# Altium schematic sheet [MP] MCU.SchDoc
size 254 x 208 mm; SheetNumber: 2; SheetTotal: 8
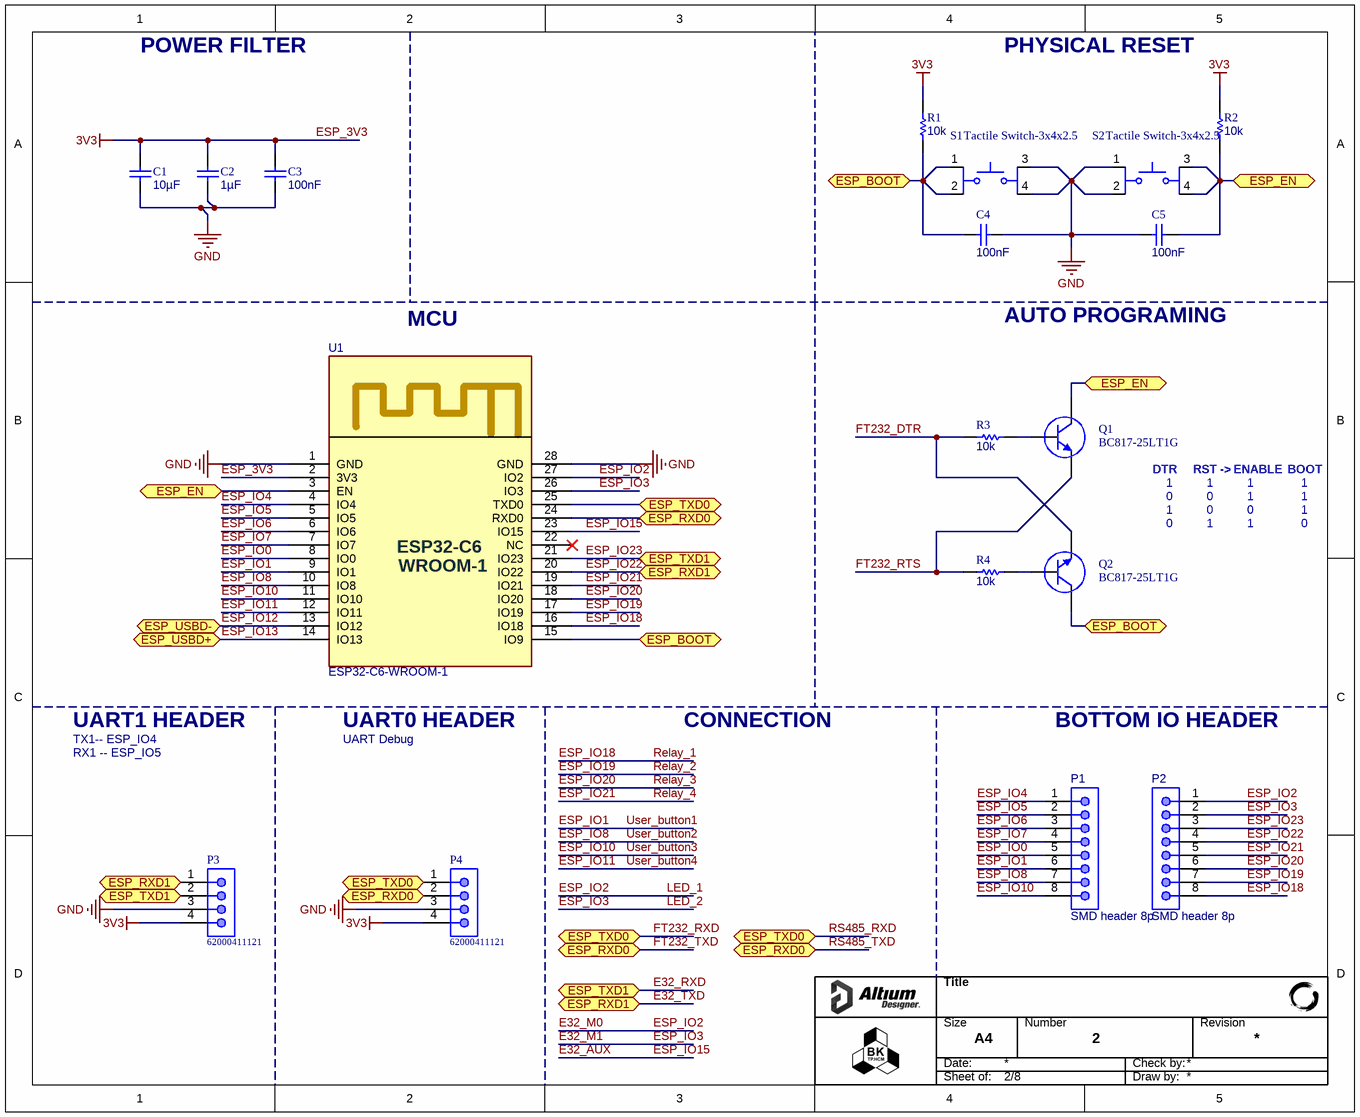
[diagram p0: [MP] MCU.SchDoc]

## Parts
C1  value 10µF  [CAP_0603]  (hidden comment: 0106031061010)
C2  value 1µF  [CAP_0603]  (hidden comment: 0106031051016)
C3  value 100nF  [CAP_0603]  (hidden comment: 0106031041050)
C4  value 100nF  [CAP_0603]  (hidden comment: 0106031041050)
C5  value 100nF  [CAP_0603]  (hidden comment: 0106031041050)
P1  SMD header 8p  [SMD header 8p]
P2  SMD header 8p  [SMD header 8p]
P3  62000411121  [62000411121]
P4  62000411121  [62000411121]
Q1  BC817-25LT1G  [ONSC-SOT-23-3-318-08_V]
Q2  BC817-25LT1G  [ONSC-SOT-23-3-318-08_V]
R1  value 10k  [RES_0603]  (hidden comment: 0006031031)
R2  value 10k  [RES_0603]  (hidden comment: 0006031031)
R3  value 10k  [RES_0603]  (hidden comment: 0006031031)
R4  value 10k  [RES_0603]  (hidden comment: 0006031031)
S1  Tactile Switch-3x4x2.5  [Tactile Switch-3x4x2.5 Footprint]
S2  Tactile Switch-3x4x2.5  [Tactile Switch-3x4x2.5 Footprint]
U1  ESP32-C6-WROOM-1  [ESP32-C6-WROOM-1-Footprint]

## Ports
ESP_BOOT (bidir), ESP_EN (bidir), ESP_RXD0 (bidir), ESP_RXD1 (bidir), ESP_TXD0 (bidir), ESP_TXD1 (bidir), ESP_USBD+ (bidir), ESP_USBD- (bidir)

## Nets
ESP_3V3: C1.2 C2.2 C3.2 P3.4 P4.4 R1.2 R2.2 U1.2(3V3)  [also labelled 3V3]
GND: C1.1 C2.1 C3.1 C4.2 C5.1 P3.3 P4.3 S1.3 S1.4 S2.1 S2.2 U1.1(GND) U1.28(GND)
E32_AUX: U1.23(IO15)  [also labelled ESP_IO15]
E32_M0: P2.1 U1.27(IO2)  [also labelled ESP_IO2, LED_1]
E32_M1: P2.2 U1.26(IO3)  [also labelled ESP_IO3, LED_2]
E32_RXD: P2.3 P3.2 U1.21(IO23) ; port ESP_TXD1  [also labelled ESP_IO23]
E32_TXD: P2.4 P3.1 U1.20(IO22) ; port ESP_RXD1  [also labelled ESP_IO22]
ESP_BOOT: C4.1 Q2.3(C) R1.1 S1.1 S1.2 U1.15(IO9) ; port ESP_BOOT
ESP_EN: C5.2 Q1.3(C) R2.1 S2.3 S2.4 U1.3(EN) ; port ESP_EN
ESP_IO0: P1.5 U1.8(IO0)
ESP_IO1: P1.6 U1.9(IO1)  [also labelled User_button1]
ESP_IO4: P1.1 U1.4(IO4)
ESP_IO5: P1.2 U1.5(IO5)
ESP_IO6: P1.3 U1.6(IO6)
ESP_IO7: P1.4 U1.7(IO7)
ESP_IO8: P1.7 U1.10(IO8)  [also labelled User_button2]
ESP_IO10: P1.8 U1.11(IO10)  [also labelled User_button3]
ESP_IO11: U1.12(IO11)  [also labelled User_button4]
ESP_IO12: U1.13(IO12) ; port ESP_USBD-
ESP_IO13: U1.14(IO13) ; port ESP_USBD+
ESP_IO18: P2.8 U1.16(IO18)  [also labelled Relay_1]
ESP_IO19: P2.7 U1.17(IO19)  [also labelled Relay_2]
ESP_IO20: P2.6 U1.18(IO20)  [also labelled Relay_3]
ESP_IO21: P2.5 U1.19(IO21)  [also labelled Relay_4]
FT232_DTR: Q2.2(E) R3.2
FT232_RTS: Q1.2(E) R4.1
FT232_RXD: P4.1 U1.25(TXD0) ; port ESP_TXD0  [also labelled RS485_RXD]
FT232_TXD: P4.2 U1.24(RXD0) ; port ESP_RXD0  [also labelled RS485_TXD]
NetQ1_1: Q1.1(B) R3.1
NetQ2_1: Q2.1(B) R4.2

Not connected (* = marked no-connect by the designer): U1 22(NC)*

## Notes on the sheet
- POWER FILTER
- PHYSICAL RESET
- MCU
- AUTO PROGRAMING
- DTR
- 1
- 0
- RST
- ->
- ENABLE
- BOOT
- UART1 HEADER
- UART0 HEADER
- CONNECTION
- BOTTOM IO HEADER
- TX1-- ESP_IO4
- RX1 -- ESP_IO5
- UART Debug
- Title
- Size
- Date:
- A4
- Number
- Check by:
- Revision
- Sheet of:
- Draw by:
- (in symbol CMP-021-00010-2) ESP32-C6; WROOM-1

## Library data of the parts
C1 = CMP-001-00181-3: CAP, size 0603, 10 uF, 10 VDC, 10%; Manufacturer: Samsung Electro-Mechanics; Manufacturer Part Number: CL10A106KP8NNNC; Voltage Rating DC: 10 VDC; Supplier 2 Part Number: 1276-1192-2-ND; Pins: 2; Design Item ID: 0106031061010; Supplier 2 URL: https://www.digikey.com/en/products/detail/samsung-electro-mechanics/cl10a106kp8nnnc/3886850; Source: Capacitor_0603_10_percent.SchLib; Component Type: Standard; Operating Temperature Min: - 40 C; Packaging: Tape and Reel; Supplier 3 Part Number: N/A; Supplier 1 URL: https://www.mouser.vn/ProductDetail/Samsung-Electro-Mechanics/CL10A106KP8NNNC?qs=X6jEic%2FHinAlyfRHj7fKwg%3D%3D; LCSC Part #: C19702; Supplier 3 URL: https://www.thegioiic.com/tu-gom-0603-10uf-25v; ComponentLink1Description: Datasheet; Operating Temperature Max: + 85 C; ComponentLink1URL: https://www.mouser.vn/datasheet/2/585/MLCC-1837944.pdf; Mount: SMD/SMT; Case/Package: 0603; Supplier 1 Part Number: 187-CL10A106KP8NNNC; Tolerance: 10%
C2 = CMP-001-00177-3: CAP, size 0603, 1 uF, 16 VDC, 10%; Manufacturer Part Number: CL10B105KO8NNWC; Manufacturer: Samsung Electro-Mechanics; Voltage Rating DC: 16 VDC; Component Type: Standard; Supplier 3 URL: https://www.thegioiic.com/tu-gom-0603-1uf-16v; Operating Temperature Max: + 85 C; Tolerance: 10%; Supplier 3 Part Number: N/A; Source: Capacitor_0603_10_percent.SchLib; Case/Package: 0603; Supplier 1 Part Number: 187-CL10B105KO8NNWC; Operating Temperature Min: - 40 C; Packaging: Tape and Reel; Design Item ID: 0106031051016; LCSC Part #: C1592; Supplier 2 Part Number: 1276-CL10B105KO8NNWCTR-ND; Supplier 2 URL: https://www.digikey.com/en/products/detail/samsung-electro-mechanics/cl10b105ko8nnwc/16572783; Supplier 1 URL: https://www.mouser.vn/ProductDetail/Samsung-Electro-Mechanics/CL10B105KO8NNWC?qs=81r%252BiQLm7BT%252BXtc72qn1ug%3D%3D&utm_source=mouser-refine-download&utm_medium=file&utm_campaign=CL10B105KO8NNWC&utm_content=Samsung-Electro-Mechanics; ComponentLink1URL: https://www.mouser.vn/datasheet/2/585/Samsung_MLCC_1837944-1929650.pdf; Pins: 2; Mount: SMD/SMT; ComponentLink1Description: Datasheet
C3-C5 = CMP-001-00176-3: CAP, size 0603, 100 nF, 50 VDC, 10%; Manufacturer Part Number: CGA3E3X8R1H104K080AE; Manufacturer: TDK; Voltage Rating DC: 50 VDC; Source: Capacitor_0603_10_percent.SchLib; Operating Temperature Min: - 40 C; Supplier 3 URL: https://www.thegioiic.com/tu-gom-0603-100nf-0-1uf-50v; Supplier 1 Part Number: 810-CGA3E3X8R1H104KA; Mount: SMD/SMT; Supplier 1 URL: https://www.mouser.com/ProductDetail/TDK/CGA3E3X8R1H104K080AE?qs=nQSIdc08i%252Bd8g3IRRgU2bw%3D%3D&utm_source=mouser-refine-download&utm_medium=file&utm_campaign=CGA3E3X8R1H104K080AE&utm_content=TDK; Packaging: Tape and Reel; Supplier 3 Part Number: N/A; LCSC Part #: C14663; ComponentLink1Description: Datasheet; Operating Temperature Max: + 85 C; Design Item ID: 0106031041050; Supplier 2 URL: https://www.digikey.com/en/products/detail/tdk-corporation/cga3e3x8r1h104k080ae/5809262; Component Type: Standard; Supplier 2 Part Number: 445-173697-2-ND; Case/Package: 0603; Tolerance: 10%; ComponentLink1URL: https://product.tdk.com/system/files/dam/doc/product/capacitor/ceramic/mlcc/catalog/mlcc_automotive_soft_en.pdf?ref_disty=mouser; Pins: 2
P1 P2 = CMP-002-01370-2
P3 P4 = CMP-002-01189-1: WR-PHD Pin Header, THT, pitch 2mm, Single Row, Vertical, 4p; Manufacturer: Wurth Elektronik; Rated Current: 2A; Contact Resistance: 20mOhm; Working Voltage: 200VAC; Value: 2A, 200 V (AC); Withstanding Voltage: 500VAC; Pin Number: 4; Pins: 4; LCSC Part #: N/A; Orientation: Vertical; Supplier 3 URL: N/A; Supplier 3 Part Number: N/A; ComponentLink1URL: https://www.we-online.com/catalog/datasheet/62000411121.pdf; Source: WR-PHD_Pin Header_2.00mm.SchLib; Design Item ID: 62000411121; Operating Temperature Min: - 40 C; Row Number: Single; ComponentLink1Description: Datasheet; Component Type: Standard; Packaging: Bag; Supplier 2 Part Number: N/A; Supplier 1 Part Number: N/A; Operating Temperature Max: + 105 C; Manufacturer Part Number: 62000411121; Supplier 2 URL: N/A; Pitch: 2mm; Gender: Pin Header; Supplier 1 URL: N/A; Mount: THT
Q1 Q2 = CMP-013-00035-2: Small Signal Bipolar Transistor, 0.5A I(C), 45V V(BR)CEO, 1-Element, NPN, Silicon, TO-236; Frequency: 100MHz; Max Operating Temperature: 150°C; RoHS Compliant: Yes; Pins: 3
R1-R4 = CMP-009-00187-5: RES, size 0603, 10 KOhm, 1/10 W, 1%; Manufacturer Part Number: RC0603FR-0710KL; Manufacturer: YAGEO; Rated Power: 1/10 W; Source: Resistor_0603.SchLib; Pins: 2; Case/Package: 0603; Packaging: Tape and Reel; ComponentLink1Description: Datasheet; Component Type: Standard; Supplier 1 URL: N/A; Design Item ID: 0006031031; Supplier 2 Part Number: 311-10.0KHRTR-ND; Supplier 2 URL: https://www.digikey.com/en/products/detail/yageo/rc0603fr-0710kl/726880; Operating Temperature Max: + 85 C; Mount: SMD/SMT; Supplier 3 URL: N/A; Supplier 1 Part Number: N/A; Operating Temperature Min: - 40 C; LCSC Part #: C98220; Supplier 3 Part Number: N/A; ComponentLink1URL: https://fscdn.rohm.com/en/products/databook/datasheet/passive/resistor/chip_resistor/esr-e.pdf; Tolerance: 1%
S1 S2 = CMP-011-00013-6: Tactile Switch, 3x4x2.5mm; Pins: 4; Mounting Technology: SMT
U1 = CMP-021-00010-2: Module that supports 2.4 GHz Wi-Fi 6 (802.11ax), Bluetooth® 5 (LE), Zigbee and